# EAGLE design CampLet_Power_Control (EAGLE 9.6.2)
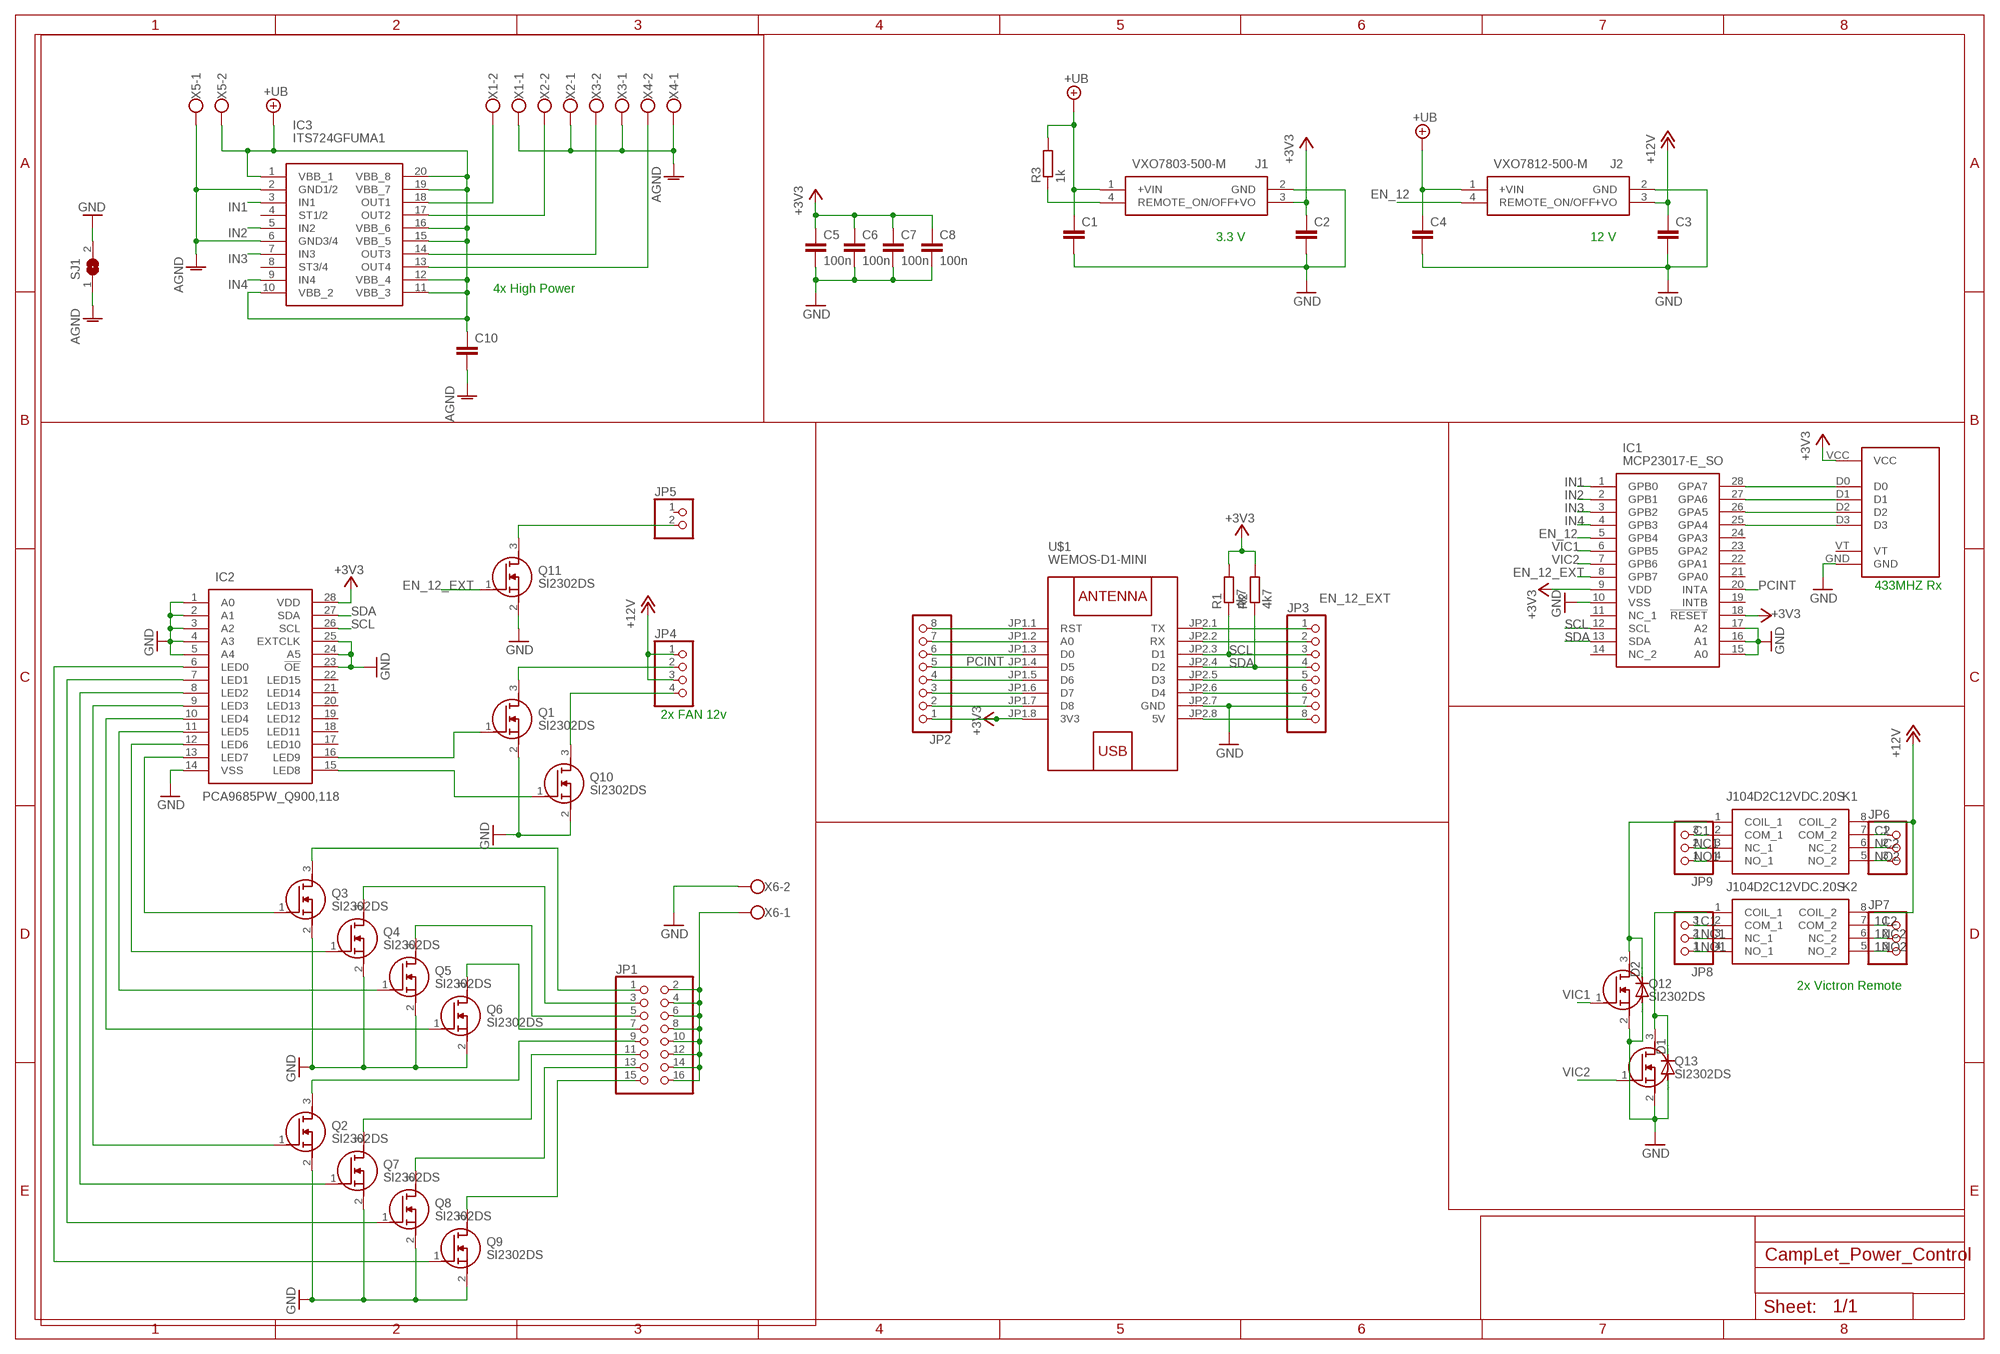
[diagram p0: schematic, sheet 1]

## Parts
C1  10u 30v CL31A106KBHNNNE  C-EUC1206  [C1206]
C2  22u 3.3v CL31A226MOCLNNC  C-EUC1206  [C1206]
C3  22u 12v CL31A226MOCLNNC  C-EUC1206  [C1206]
C4  10u 30v CL31A106KBHNNNE  C-EUC1206  [C1206]
C5  100n  C-EUC0805  [C0805]
C6  100n  C-EUC0805  [C0805]
C7  100n  C-EUC0805  [C0805]
C8  100n  C-EUC0805  [C0805]
C10  10u 30v CL31A106KBHNNNE  C-EUC1206  [C1206]
D1  1N4148DO35-7  [DO35-7]
D2  1N4148DO35-7  [DO35-7]
IC1  MCP23017-E_SO  [SOIC127P1030X265-28N]
IC2  PCA9685PW_Q900,118  [SOP65P640X110-28N]
IC3  ITS724GFUMA1  [SOIC127P1030X265-20N]
J1  VXO7803-500-M  VXO7803-500-M-TR  [VXO7803500MTR]
J2  VXO7812-500-M  VXO7803-500-M-TR  [VXO7803500MTR]
JP1  PINHD-2X8  [2X08]
JP2  PINHD-1X8  [1X08]
JP3  PINHD-1X8  [1X08]
JP4  PINHD-1X4  [1X04]
JP5  PINHD-1X2  [1X02]
JP6  PINHD-1X3  [1X03]
JP7  PINHD-1X3  [1X03]
JP8  PINHD-1X3  [1X03]
JP9  PINHD-1X3  [1X03]
K1  J104D2C12VDC.20S  [J104D2C12VDC20S]
K2  J104D2C12VDC.20S  [J104D2C12VDC20S]
Q1  SI2302DS  [SOT95P230X110-3N]
Q2  SI2302DS  [SOT95P230X110-3N]
Q3  SI2302DS  [SOT95P230X110-3N]
Q4  SI2302DS  [SOT95P230X110-3N]
Q5  SI2302DS  [SOT95P230X110-3N]
Q6  SI2302DS  [SOT95P230X110-3N]
Q7  SI2302DS  [SOT95P230X110-3N]
Q8  SI2302DS  [SOT95P230X110-3N]
Q9  SI2302DS  [SOT95P230X110-3N]
Q10  SI2302DS  [SOT95P230X110-3N]
Q11  SI2302DS  [SOT95P230X110-3N]
Q12  SI2302DS  [SOT95P230X110-3N]
Q13  SI2302DS  [SOT95P230X110-3N]
R1  4k7  R-EU_R0805  [R0805]
R2  4k7  R-EU_R0805  [R0805]
R3  1k  R-EU_R0805  [R0805]
SJ1  SJ  [SJ]
U$1  WEMOS-D1-MINI  [WEMOS-D1-MINI]
U$2  433MHZ  [433MHZ]
X1  W237-102  [W237-102]
X2  W237-102  [W237-102]
X3  W237-102  [W237-102]
X4  W237-102  [W237-102]
X5  W237-102  [W237-102]
X6  W237-102  [W237-102]

## Nets
1C1: JP8.3 K2.2(COM_1)
1C2: JP7.1 K2.7(COM_2)
1NC1: JP8.2 K2.3(NC_1)
1NC2: JP7.2 K2.6(NC_2)
1NO1: JP8.1 K2.4(NO_1)
1NO2: JP7.3 K2.5(NO_2)
+3V3: C2.1 C5.1 C6.1 C7.1 C8.1 IC1.9(VDD) IC1.18(!RESET) IC2.28(VDD) J1.3(+VO) JP2.1 R1.2 R2.2 U$1.JP1.8(3V3) U$2.VCC
+12V: C3.1 J2.3(+VO) JP4.1 JP4.3 K1.8(COIL_2) K2.8(COIL_2)
+UB: C1.1 C4.1 C10.1 IC3.1(VBB_1) IC3.10(VBB_2) IC3.11(VBB_3) IC3.12(VBB_4) IC3.15(VBB_5) IC3.16(VBB_6) IC3.19(VBB_7) IC3.20(VBB_8) J1.1(+VIN) J2.1(+VIN) R3.2 X5.2
AGND: C10.2 IC3.2(GND1/2) IC3.6(GND3/4) SJ1.1 X1.1 X2.1 X3.1 X4.1 X5.1
C1: JP9.3 K1.2(COM_1)
C2: JP6.1 K1.7(COM_2)
EN_12: IC1.5(GPB4) J2.4(REMOTE_ON/OFF)
EN_12_EXT: IC1.8(GPB7) Q11.1(G)
GND: C1.2 C2.2 C3.2 C4.2 C5.2 C6.2 C7.2 C8.2 D1.A D2.A IC1.10(VSS) IC1.15(A0) IC1.16(A1) IC1.17(A2) IC2.1(A0) IC2.2(A1) IC2.3(A2) IC2.4(A3) IC2.5(A4) IC2.14(VSS) IC2.23(!OE) IC2.24(A5) IC2.25(EXTCLK) J1.2(GND) J2.2(GND) JP3.7 Q1.2(S) Q2.2(S) Q3.2(S) Q4.2(S) Q5.2(S) Q6.2(S) Q7.2(S) Q8.2(S) Q9.2(S) Q10.2(S) Q11.2(S) Q12.2(S) Q13.2(S) SJ1.2 U$1.JP2.7(GND) U$2.GND X6.2
IN1: IC1.1(GPB0) IC3.3(IN1)
IN2: IC1.2(GPB1) IC3.5(IN2)
IN3: IC1.3(GPB2) IC3.7(IN3)
IN4: IC1.4(GPB3) IC3.9(IN4)
N$1: IC1.28(GPA7) U$2.D0
N$2: IC1.27(GPA6) U$2.D1
N$3: IC1.26(GPA5) U$2.D2
N$4: IC1.25(GPA4) U$2.D3
N$5: IC2.12(LED6) Q4.1(G)
N$6: IC2.13(LED7) Q3.1(G)
N$7: IC2.11(LED5) Q5.1(G)
N$8: IC2.10(LED4) Q6.1(G)
N$9: IC2.9(LED3) Q2.1(G)
N$10: IC2.8(LED2) Q7.1(G)
N$11: IC2.7(LED1) Q8.1(G)
N$12: IC2.6(LED0) Q9.1(G)
N$13: JP1.9 Q2.3(D)
N$14: JP1.11 Q7.3(D)
N$15: JP1.13 Q8.3(D)
N$16: JP1.15 Q9.3(D)
N$17: JP1.1 Q3.3(D)
N$18: JP1.3 Q4.3(D)
N$19: JP1.5 Q5.3(D)
N$20: JP1.7 Q6.3(D)
N$21: JP1.2 JP1.4 JP1.6 JP1.8 JP1.10 JP1.12 JP1.14 JP1.16 X6.1
N$22: IC3.17(OUT2) X2.2
N$23: IC3.14(OUT3) X3.2
N$24: IC3.13(OUT4) X4.2
N$25: JP3.8 U$1.JP2.8(5V)
N$26: IC2.16(LED9) Q1.1(G)
N$27: JP3.6 U$1.JP2.6(D4)
N$28: JP3.5 U$1.JP2.5(D3)
N$29: JP3.2 U$1.JP2.2(RX)
N$30: JP3.1 U$1.JP2.1(TX)
N$31: JP2.2 U$1.JP1.7(D8)
N$32: JP2.3 U$1.JP1.6(D7)
N$33: JP2.4 U$1.JP1.5(D6)
N$34: JP2.6 U$1.JP1.3(D0)
N$35: JP2.7 U$1.JP1.2(A0)
N$36: JP2.8 U$1.JP1.1(RST)
N$38: J1.4(REMOTE_ON/OFF) R3.1
N$39: IC2.15(LED8) Q10.1(G)
N$41: JP5.2 Q11.3(D)
N$43: D2.C K1.1(COIL_1) Q12.3(D)
N$44: JP4.2 Q1.3(D)
N$45: JP4.4 Q10.3(D)
N$46: D1.C K2.1(COIL_1) Q13.3(D)
NC1: JP9.2 K1.3(NC_1)
NC2: JP6.2 K1.6(NC_2)
NO1: JP9.1 K1.4(NO_1)
NO2: JP6.3 K1.5(NO_2)
OUT1: IC3.18(OUT1) X1.2
PCINT: IC1.20(INTA) JP2.5 U$1.JP1.4(D5)
SCL: IC1.12(SCL) IC2.26(SCL) JP3.3 R1.1 U$1.JP2.3(D1)
SDA: IC1.13(SDA) IC2.27(SDA) JP3.4 R2.1 U$1.JP2.4(D2)
VIC1: IC1.6(GPB5) Q12.1(G)
VIC2: IC1.7(GPB6) Q13.1(G)
Unconnected: IC1.11(NC_1) IC1.14(NC_2) IC1.19(INTB) IC1.21(GPA0) IC1.22(GPA1) IC1.23(GPA2) IC1.24(GPA3) IC2.17(LED10) IC2.18(LED11) IC2.19(LED12) IC2.20(LED13) IC2.21(LED14) IC2.22(LED15) IC3.4(ST1/2) IC3.8(ST3/4) JP5.1 U$2.VT

## Notes on the sheet
- 3.3 V | 12 V
- 4x High Power
- 433MHZ Rx
- 2x FAN 12v
- 2x Victron Remote

## Library data of the parts
C1-C8 C10 = rcl:C-EU: CAPACITOR, European symbol; SPICEPREFIX: C
D1 D2 = diode:1N4148: DIODE high speed (Philips)
IC1 = MCP23017-E_SO:MCP23017-E_SO: 16-bit I/O Expander,I2C,MCP23017-E/SO Source: Datasheet <http://docs-emea.rs-online.com/webdocs/0a78/0900766b80a784c3.pdf>; ARROW_PART_NUMBER: MCP23017-E/SO; ARROW_PRICE-STOCK: https://www.arrow.com/en/products/mcp23017-eso/microchip-technology; DESCRIPTION: 16-bit I/O Expander,I2C,MCP23017-E/SO; HEIGHT: 2.65mm; MANUFACTURER_NAME: Microchip; MANUFACTURER_PART_NUMBER: MCP23017-E/SO; MOUSER_PART_NUMBER: 579-MCP23017-E/SO; MOUSER_PRICE-STOCK: https://www.mouser.co.uk/ProductDetail/Microchip-Technology/MCP23017-E-SO?qs=usxtMOJb1Rz8hft7vV7YMQ%3D%3D
IC2 = PCA9685PW_Q900_118:PCA9685PW_Q900,118: NXP - PCA9685PW/Q900,118 - LED DRIVER, AEC-Q100, 16-CH, TSSOP-20 Source: Datasheet <http://www.nxp.com/docs/en/data-sheet/PCA9685.pdf>; ARROW_PART_NUMBER: PCA9685PW/Q900,118; ARROW_PRICE-STOCK: https://www.arrow.com/en/products/pca9685pwq900118/nxp-semiconductors; DESCRIPTION: NXP - PCA9685PW/Q900,118 - LED DRIVER, AEC-Q100, 16-CH, TSSOP-20; HEIGHT: 1.1mm; MANUFACTURER_NAME: NXP; MANUFACTURER_PART_NUMBER: PCA9685PW/Q900,118; MOUSER_PART_NUMBER: 771-PCA9685PWQ900118; MOUSER_PRICE-STOCK: https://www.mouser.co.uk/ProductDetail/NXP-Semiconductors/PCA9685PW-Q900118/?qs=MWRe%252BjyhxRtZfKNN86P1Tg%3D%3D
IC3 = ITS724GFUMA1:ITS724GFUMA1: INFINEON - ITS724GFUMA1 - IC, 4CH HIGH SIDE PWR SWITCH, DSO-20 Source: Datasheet <https://www.infineon.com/dgdl/Infineon-ITS724G-DS-v01_01-en.pdf?fileId=db3a304412b407950112b428d6083e90>; ARROW_PART_NUMBER: ITS724GFUMA1; ARROW_PRICE-STOCK: https://www.arrow.com/en/products/its724gfuma1/infineon-technologies-ag; DESCRIPTION: INFINEON - ITS724GFUMA1 - IC, 4CH HIGH SIDE PWR SWITCH, DSO-20; HEIGHT: 2.65mm; MANUFACTURER_NAME: Infineon; MANUFACTURER_PART_NUMBER: ITS724GFUMA1; MOUSER_PART_NUMBER: 726-ITS724GFUMA1; MOUSER_PRICE-STOCK: https://www.mouser.co.uk/ProductDetail/Infineon-Technologies/ITS724GFUMA1?qs=OwbwYO03UsLF67j8ijxCVQ%3D%3D
J1 J2 = VXO7803-500-M-TR:VXO7803-500-M-TR: Non-Isolated DC/DC Converters dc-dc non-isolated, 0.5 A, 4.75~36 Vdc input, 3.3 Vdc output, SMT, open frame, tape and reel Source: Datasheet <https://www.mouser.ch/datasheet/2/670/vxo78-500-m-1729064.pdf>; ARROW_PART_NUMBER: VXO7803-500-M-TR; ARROW_PRICE-STOCK: https://www.arrow.com/en/products/vxo7803-500-m-tr/cui-inc; DESCRIPTION: Non-Isolated DC/DC Converters dc-dc non-isolated, 0.5 A, 4.75~36 Vdc input, 3.3 Vdc output, SMT, open frame, tape and reel; HEIGHT: 3.5mm; MANUFACTURER_NAME: CUI Inc.; MANUFACTURER_PART_NUMBER: VXO7803-500-M-TR; MOUSER_PART_NUMBER: 490-VXO7803-500-M-TR; MOUSER_PRICE-STOCK: https://www.mouser.co.uk/ProductDetail/CUI-Inc/VXO7803-500-M-TR?qs=GBLSl2AkiruqsgUrpmz5tw%3D%3D
JP1 = pinhead:PINHD-2X8: PIN HEADER
JP2 JP3 = pinhead:PINHD-1X8: PIN HEADER
JP4 = pinhead:PINHD-1X4: PIN HEADER
JP5 = pinhead:PINHD-1X2: PIN HEADER
JP6-JP9 = pinhead:PINHD-1X3: PIN HEADER
K1 K2 = J104D2C12VDC.20S:J104D2C12VDC.20S: Relay 20.4 x 10.05 x 11.0 mm DPDT 20W Source: Datasheet <https://www.citrelay.com/Catalog Pages/RelayCatalog/J104D.pdf>; DESCRIPTION: Relay 20.4 x 10.05 x 11.0 mm DPDT 20W; HEIGHT: 11.42mm; MANUFACTURER_NAME: CITRelay; MANUFACTURER_PART_NUMBER: J104D2C12VDC.20S
Q1-Q13 = SI2302DS:SI2302DS: NXP SI2302DS N-channel MOSFET Transistor, 2.5 A, 20 V, 3-Pin TO-236AB Source: Datasheet <https://assets.nexperia.com/documents/data-sheet/SI2302DS.pdf>; DESCRIPTION: NXP SI2302DS N-channel MOSFET Transistor, 2.5 A, 20 V, 3-Pin TO-236AB; HEIGHT: 1.1mm; MANUFACTURER_NAME: Nexperia; MANUFACTURER_PART_NUMBER: SI2302DS; MOUSER_PART_NUMBER: N/A; MOUSER_PRICE-STOCK: https://www.mouser.com/Search/Refine.aspx?Keyword=N%2FA
R1-R3 = rcl:R-EU_: RESISTOR, European symbol; SPICEPREFIX: R
SJ1 = jumper:SJ: SMD solder JUMPER
U$1 = diy-modules:WEMOS-D1-MINI: WEMOS D1 mini: Mini Wi-Fi Board based on ESP-8266 device More details can be found here: https://www.wemos.cc/product/d1-mini.html Click here to find device on ebay.com <http://www.ebay.com/sch/wemos+d1+mini+nodemcu>
U$2 = 433Mhz:433MHZ
X1-X6 = con-wago-500:W237-102: WAGO SCREW CLAMP; MPN: 237-102; OC_FARNELL: unknown; OC_NEWARK: 70K9898

## Board
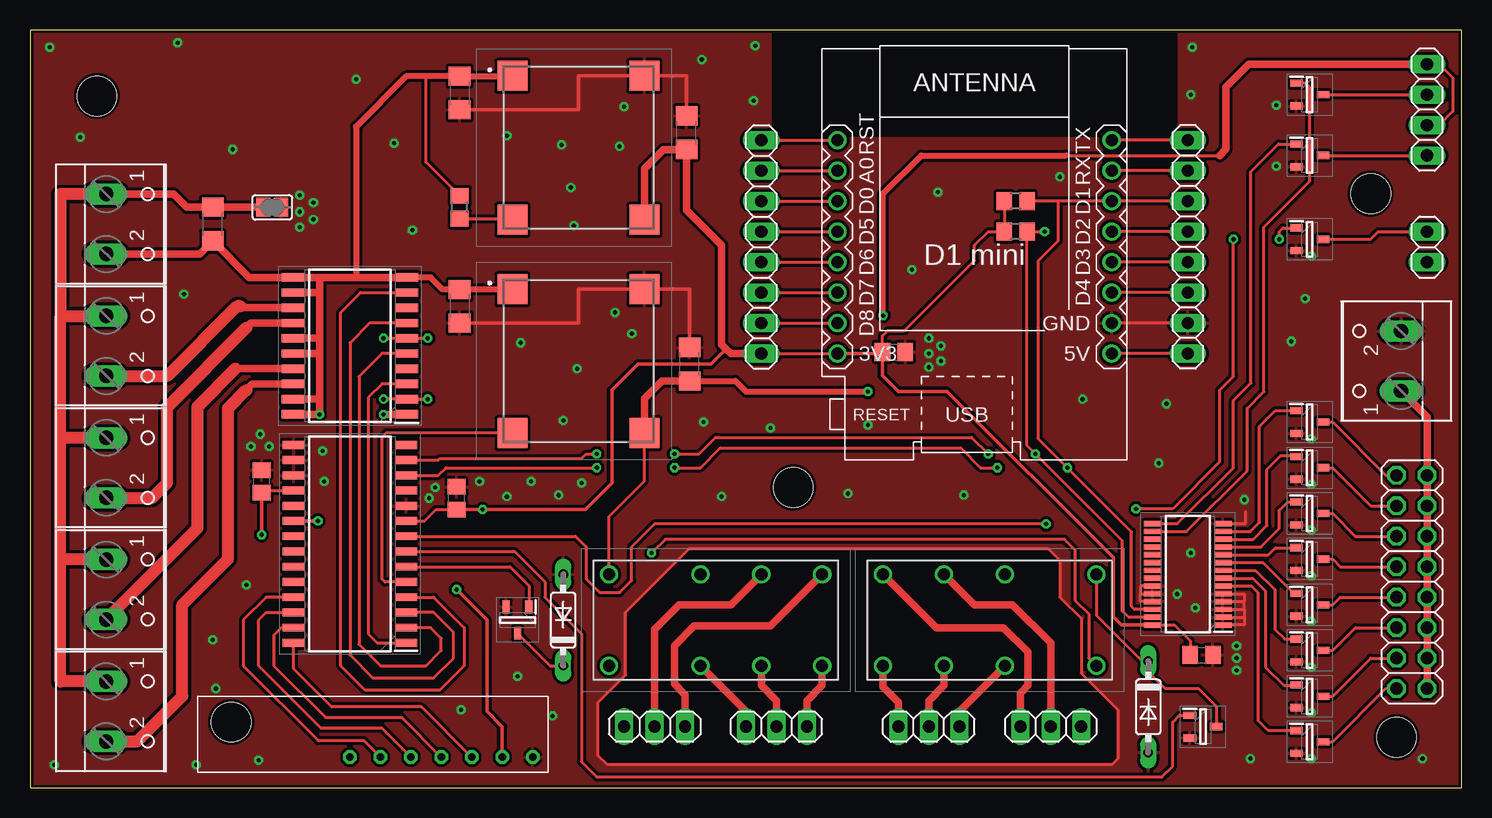
[diagram p1: board, top side]
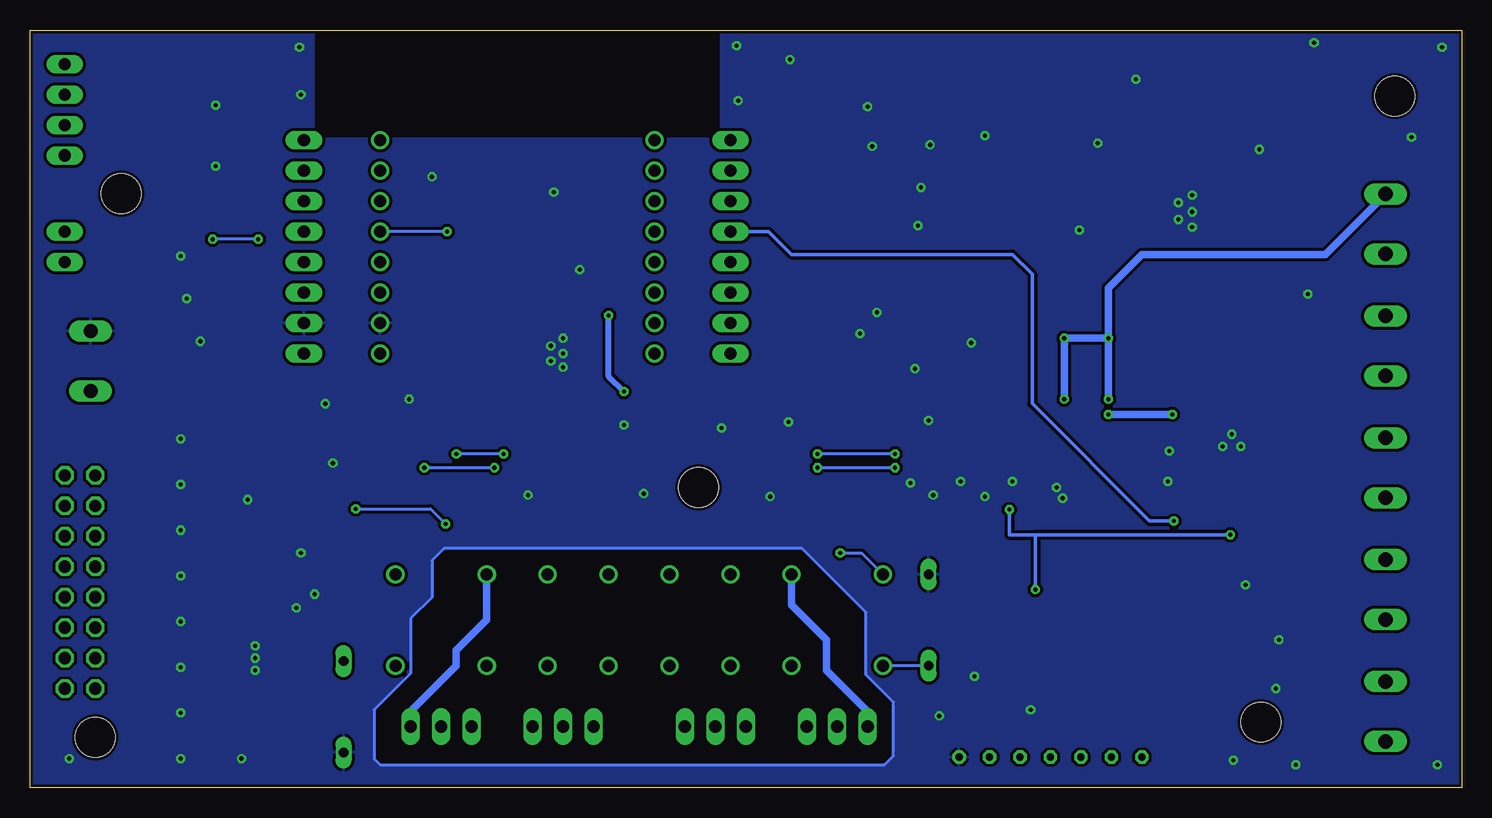
[diagram p2: board, bottom side, seen from below]

Size 119.36 x 63.17 mm. Coordinates in mm from the lower left corner, seen from the top.
Outline: 0,0 119.36,0 119.36,63.17 0,63.17 0,0
Copper layers (1*16): Top 0.035mm / dielectric 1.5mm / Bottom 0.035mm
Design rules "jlcpcb": minimum track width 3.5mil, minimum drill 0.2mm, track to track 3.5mil, track to pad 5mil, pad to pad 5mil, via to via 5mil, smd to smd 5mil, copper to edge 0.2mm, drill to drill 8mil, minimum pad ring 10mil, minimum via ring 8mil, stop-mask expansion 4mil, vias tented up to drill 0mil, thermal gap 10mil
Holes 3.3 mm at 63.63,25.02 5.59,57.66 111.76,49.53 113.92,4.19 16.76,5.46
tRestrict: area 62.2,54.6 to 95.2,63.5; area 47.6,2.2 to 90.4,19.7
bRestrict: area 62.2,54.6 to 95.2,63.5; area 47.6,2.2 to 90.4,19.7

### Footprints (pad centres in the part's own frame; a part is rotated, then mirrored left to right if it is on the bottom)
C1206 = smd 1.6 x 1.8: 1 -1.4,0; 2 1.4,0
C0805 = smd 1.3 x 1.5: 1 -0.95,0; 2 0.95,0
DO35-7 = drill 0.813 long: A 3.81,0; C -3.81,0
SOIC127P1030X265-28N = smd 1.85 x 0.65: 1 -4.675,8.255; 2 -4.675,6.985; 3 -4.675,5.715; 4 -4.675,4.445; 5 -4.675,3.175; 6 -4.675,1.905; 7 -4.675,0.635; 8 -4.675,-0.635; 9 -4.675,-1.905; 10 -4.675,-3.175; 11 -4.675,-4.445; 12 -4.675,-5.715; 13 -4.675,-6.985; 14 -4.675,-8.255; 15 4.675,-8.255; 16 4.675,-6.985; 17 4.675,-5.715; 18 4.675,-4.445; 19 4.675,-3.175; 20 4.675,-1.905; 21 4.675,-0.635; 22 4.675,0.635; 23 4.675,1.905; 24 4.675,3.175; 25 4.675,4.445; 26 4.675,5.715; 27 4.675,6.985; 28 4.675,8.255
SOP65P640X110-28N = smd 1.475 x 0.45: 1 -2.938,4.225; 2 -2.938,3.575; 3 -2.938,2.925; 4 -2.938,2.275; 5 -2.938,1.625; 6 -2.938,0.975; 7 -2.938,0.325; 8 -2.938,-0.325; 9 -2.938,-0.975; 10 -2.938,-1.625; 11 -2.938,-2.275; 12 -2.938,-2.925; 13 -2.938,-3.575; 14 -2.938,-4.225; 15 2.938,-4.225; 16 2.938,-3.575; 17 2.938,-2.925; 18 2.938,-2.275; 19 2.938,-1.625; 20 2.938,-0.975; 21 2.938,-0.325; 22 2.938,0.325; 23 2.938,0.975; 24 2.938,1.625; 25 2.938,2.275; 26 2.938,2.925; 27 2.938,3.575; 28 2.938,4.225
SOIC127P1030X265-20N = smd 1.925 x 0.7: 1 -4.712,5.715; 2 -4.712,4.445; 3 -4.712,3.175; 4 -4.712,1.905; 5 -4.712,0.635; 6 -4.712,-0.635; 7 -4.712,-1.905; 8 -4.712,-3.175; 9 -4.712,-4.445; 10 -4.712,-5.715; 11 4.712,-5.715; 12 4.712,-4.445; 13 4.712,-3.175; 14 4.712,-1.905; 15 4.712,-0.635; 16 4.712,0.635; 17 4.712,1.905; 18 4.712,3.175; 19 4.712,4.445; 20 4.712,5.715
VXO7803500MTR = smd 2.5 x 2.5: 1 -5.5,6; 2 5.5,6; 3 5.5,-6; 4 -5.5,-6
2X08 = drill 1.016 octagon: 1 -8.89,-1.27; 2 -8.89,1.27; 3 -6.35,-1.27; 4 -6.35,1.27; 5 -3.81,-1.27; 6 -3.81,1.27; 7 -1.27,-1.27; 8 -1.27,1.27; 9 1.27,-1.27; 10 1.27,1.27; 11 3.81,-1.27; 12 3.81,1.27; 13 6.35,-1.27; 14 6.35,1.27; 15 8.89,-1.27; 16 8.89,1.27
1X08 = drill 1.016 long: 1 -8.89,0; 2 -6.35,0; 3 -3.81,0; 4 -1.27,0; 5 1.27,0; 6 3.81,0; 7 6.35,0; 8 8.89,0
1X04 = drill 1.016 long: 1 -3.81,0; 2 -1.27,0; 3 1.27,0; 4 3.81,0
1X02 = drill 1.016 long: 1 -1.27,0; 2 1.27,0
1X03 = drill 1.016 long: 1 -2.54,0; 2 0,0; 3 2.54,0
J104D2C12VDC20S = drill 1 pad 1.5: 1 0,-7.62; 2 7.62,-7.62; 3 12.7,-7.62; 4 17.78,-7.62; 5 17.78,0; 6 12.7,0; 7 7.62,0; 8 0,0
SOT95P230X110-3N = smd 1.05 x 0.6: 1 -1.1,0.95; 2 -1.1,-0.95; 3 1.1,0
R0805 = smd 1.3 x 1.5: 1 -0.95,0; 2 0.95,0
SJ = smd 1.168 x 1.6: 1 -0.762,0; 2 0.762,0
WEMOS-D1-MINI = drill 1: JP1.1 -11.43,9.525; JP1.2 -11.43,6.985; JP1.3 -11.43,4.445; JP1.4 -11.43,1.905; JP1.5 -11.43,-0.635; JP1.6 -11.43,-3.175; JP1.7 -11.43,-5.715; JP1.8 -11.43,-8.255; JP2.1 11.43,9.525; JP2.2 11.43,6.985; JP2.3 11.43,4.445; JP2.4 11.43,1.905; JP2.5 11.43,-0.635; JP2.6 11.43,-3.175; JP2.7 11.43,-5.715; JP2.8 11.43,-8.255
433MHZ = drill 0.6 octagon: D0 -5.08,0; D1 -7.62,0; D2 -10.16,0; D3 -12.7,0; GND 0,0; VCC -2.54,0; VT -15.24,0
W237-102 = drill 1.194 long: 1 -2.5,-1.27; 2 2.5,-1.27

### Placement (x,y rotation side)
C1  35.81,40.13 270 top
C2  54.74,54.61 90 top
C3  54.99,35.31 90 top
C4  35.81,57.91 270 top
C5  19.3,25.53 90 top
C6  35.56,24.13 90 top
C7  97.66,11.05 0 top
C8  72.01,36.32 0 top
C10  15.24,46.99 90 top
D1  93.22,6.73 270 top
D2  44.45,13.97 90 top
IC1  26.67,20.32 180 top
IC2  96.52,17.78 180 top
IC3  26.67,36.83 180 top
J1  45.72,53.34 0 top
J2  45.72,35.56 0 top
JP1  115.19,17.14 270 top
JP2  60.96,45.09 90 top
JP3  96.52,45.09 270 top
JP4  116.46,56.52 270 top
JP5  116.46,45.09 90 top
JP6  52.07,5.08 0 top
JP7  74.93,5.08 180 top
JP8  85.09,5.08 0 top
JP9  62.23,5.08 180 top
K1  48.26,17.78 0 top
K2  88.9,10.16 180 top
Q1  106.68,57.78 0 top
Q2  106.68,15.24 0 top
Q3  106.68,30.48 0 top
Q4  106.68,26.67 0 top
Q5  106.68,22.86 0 top
Q6  106.68,19.05 0 top
Q7  106.68,11.43 0 top
Q8  106.68,7.62 0 top
Q9  106.68,3.81 0 top
Q10  106.68,52.7 0 top
Q11  106.68,45.72 0 top
Q12  40.64,13.97 270 top
Q13  97.79,5.08 0 top
R1  82.17,48.9 180 top
R2  82.17,46.35 180 top
R3  35.81,48.39 90 top
SJ1  20.19,48.39 0 top
U$1  78.74,44.45 0 top
U$2  41.91,2.54 0 top
X1  7.62,6.35 270 top
X2  7.62,16.51 270 top
X3  7.62,26.67 270 top
X4  7.62,36.83 270 top
X5  7.62,46.99 270 top
X6  113.03,35.56 90 top

### Tracks (layer width: path | path; a pad name or v marks a point on that pad's centre or on a via)
1C1
  Bottom 0.61: JP8.3 87.63,6.35 83.82,10.16 83.82,11.43 81.28,13.97 K2.2
1C2
  Top 0.61: JP7.1 77.47,6.35 K2.7
1NC1
  Top 0.61: K2.3 78.74,15.24 81.92,15.24 85.09,12.06 JP8.2
1NC2
  Top 0.61: JP7.2 74.93,7.24 76.2,8.51 K2.6
1NO1
  Top 0.61: JP8.1 82.55,7.87 83.19,8.51 83.19,11.3 81.15,13.34 75.56,13.34 K2.4
1NO2
  Top 0.61: JP7.3 72.39,7.11 71.12,8.38 K2.5
+3V3  (via drill 0.35)
  Top 0.254: JP2.1 U$1.JP1.8 | C5.1 19.49,24.77 IC1.18 | IC1.9 32.89,22.23 33.85,23.18 C6.1 | IC2.28 95.41,13.55 96.71,12.25 C7.1 | C8.1 71.06,37.66 71.5,38.1 72.9,38.1 78.74,43.94 78.74,45.21 79.88,46.35 R2.2 R1.2
  Top 0.305: C6.1 v37.72,23.18 46.29,23.18 48.51,25.4 48.51,33.15 50.67,35.31 56.77,35.31 58.04,36.58 | U$1.JP1.8 70.93,36.2 C8.1 71.06,34.35 72.39,33.02 76.45,33.02 90.3,19.18 90.3,14.22 90.97,13.55 IC2.28 | U$2.VCC 39.37,5.08 38.1,6.35 38.1,13.97 v35.56,16.51 | C5.1 v19.3,21.08
  Top 0.61: JP2.1 58.42,36.2 58.04,36.58 57.66,36.96 57.66,45.21 54.74,48.13 C2.1 52.83,53.21 51.22,51.6 J1.3
  Bottom 0.305: v19.3,21.08 35.56,21.08 | 35.56,21.08 v35.56,16.51 | v37.72,23.18 37.72,21.08 35.56,21.08
+12V  (via drill 0.35)
  Top 0.254: JP4.1 117.47,60.33 118.62,59.18 118.62,56.39 117.47,55.24 JP4.3 | 86.36,52.7 99.19,52.7 | K1.8 48.26,22.61 51.22,25.57 J2.3 | v51.82,19.56 52.96,20.7 86.23,20.7 87.12,19.81 87.12,15.62 88.27,14.48 88.27,10.79 K2.8
  Top 0.508: C3.1 58.8,33.91 59.69,33.02 v69.85,33.02 | v71.12,39.37 71.12,49.53 74.3,52.7 86.36,52.7
  Top 0.61: 99.19,52.7 99.69,53.21 99.69,58.42 101.6,60.33 JP4.1 | J2.3 51.22,32.42 52.7,33.91 C3.1
  Bottom 0.254: v51.82,19.56 50.04,19.56 K1.8
  Bottom 0.508: v69.85,33.02 71.12,34.29 v71.12,39.37
+UB  (via drill 0.35)
  Top 0.254: R3.2 33.02,52.13 33.02,59.31
  Top 0.508: J2.1 35.84,41.56 C1.1 34.41,41.53 33.4,42.55 IC3.10 | J1.1 40.19,59.31 C4.1 33.02,59.31 31.37,59.31 27.18,55.12 27.18,42.55
  Top 0.61: IC3.20 v24.13,31.11 24.13,32.38 | 24.13,42.55 IC3.11 18.29,42.55 C10.1 14.14,44.49 X5.2 | 24.13,42.55 24.13,41.27 | 24.13,41.27 24.13,37.47 | 24.13,36.2 24.13,32.38 | IC3.12 24.13,41.27 | IC3.19 24.13,32.38 | IC3.16 24.13,36.2 | IC3.15 24.13,37.47 | 24.13,37.47 24.13,36.2 | IC3.10 27.18,42.55 24.13,42.55 | IC3.1 v29.46,31.11
  Bottom 0.61: v29.46,31.11 v24.13,31.11
AGND  (via drill 0.35)
  Top 0.254: v29.46,37.47 IC3.6 v33.15,37.47 | v33.15,32.38 IC3.2 v29.46,32.38
  Top 0.61: X5.1 11.98,49.49 13.08,48.39 C10.2 SJ1.1
  Top 1.016: X5.1 2.54,49.49 2.54,39.33 | 2.54,39.33 X4.1 | X3.1 2.54,29.17 | 2.54,29.17 2.54,39.33 | X2.1 2.54,19.01 | 2.54,19.01 2.54,29.17 | X1.1 2.54,8.85 2.54,19.01
  Bottom 0.61: v33.15,32.38 v33.15,37.47 v29.46,37.47 | v29.46,32.38 v29.46,37.47 | v29.46,37.47 29.46,41.66 26.67,44.45 11.39,44.45 X5.1
C1
  Top 0.61: JP9.3 59.69,6.35 K1.2
C2
  Bottom 0.61: JP6.1 49.53,6.35 52.96,9.78 52.96,12.32 55.88,15.24 K1.7
EN_12
  Top 0.254: IC1.5 29.59,17.14 29.34,17.4 29.34,29.21 29.72,29.59 40.19,29.59 J2.4
EN_12_EXT  (via drill 0.35)
  Top 0.254: v100.33,45.72 100.33,34.29 99.19,33.15 99.19,27.18 95.25,23.24 v92.2,23.24 | v104.14,45.72 104.14,46.35 104.45,46.67 Q11.1 | IC1.8 45.47,20.95 46.35,20.07 46.35,17.4 47.5,16.26 49.15,16.26 50.16,17.27 50.16,20.07 52.07,21.97 v84.71,21.97
  Bottom 0.254: v100.33,45.72 v104.14,45.72 | v92.2,23.24 85.98,23.24 v84.71,21.97
GND  (via drill 0.35)
  Top 0.254: IC2.5 101.22,16.16 101.22,15.51 | IC2.1 101.22,13.55 101.22,14.21 | 101.22,14.86 101.22,14.21 | IC2.2 101.22,14.21 | IC2.3 101.22,14.86 | 101.22,14.86 101.22,15.51 | IC2.4 101.22,15.51 | IC2.14 101.35,22 101.35,22.99 | IC2.25 92.58,15.51 92.58,16.16 | 92.58,16.16 IC2.24 | IC2.23 92.58,16.8 92.58,16.16 | JP3.7 U$1.JP2.7 | 54.99,19.94 84.84,19.94 85.85,18.92 85.85,15.88 87.63,14.1 87.63,9.53 90.68,6.48 90.68,2.41 90.17,1.91 48.13,1.91 47.37,2.67 47.37,7.11 49.66,9.4 49.66,14.61 54.99,19.94
  Top 0.305: C2.2 54.74,59.34 J1.2 45.72,59.34 45.72,56.51 C4.2 | C3.2 54.99,41.56 J2.2 45.72,41.56 45.72,38.73 C1.2
  Bottom 0.254: 54.99,19.94 84.84,19.94 85.85,18.92 85.85,15.88 87.63,14.1 87.63,9.53 90.68,6.48 90.68,2.41 90.17,1.91 48.13,1.91 47.37,2.67 47.37,7.11 49.66,9.4 49.66,14.61 54.99,19.94
  other vias: 74.93,37.47 74.93,35.05 74.93,36.2 75.95,36.83 75.95,35.56 101.22,24 100.58,11.81 100.58,10.79 100.58,9.78 18.41,28.45 19.94,28.45 19.18,29.46 22.48,46.74 22.48,48.01 22.48,49.4 23.62,48.77 23.62,47.37 39.75,54.36 49.53,56.77 45.09,50.04 49.15,53.47 40.89,37.08 48.77,39.62 45.59,34.92 44.45,30.61 50.16,37.85 44.32,53.59 45.34,46.86 57.66,24.26 77.85,24.38 68.2,24.51 101.73,2.41 116.08,2.41 96.9,61.72 94.74,32 94.11,27.05 33.27,24.13 33.78,25.02 37.47,25.53 39.75,24.26 41.78,25.53 44.07,24.38 45.97,25.4 56.13,30.48 61.72,29.97 69.85,30.23 106.81,2.41 106.81,6.22 106.81,10.03 106.81,13.84 106.81,17.65 106.81,21.46 106.81,29.08 106.81,25.27 106.81,44.32 103.89,51.82 103.89,56.9 96.77,57.78 60.45,61.85 60.33,57.28 56.01,60.71 1.65,61.72 4.19,54.23 12.32,62.1 16.89,53.21 27.18,59.05 105.16,37.21 13.84,1.91 19.05,2.29 15.49,8.26 2.03,1.91 12.83,41.15 73.53,43.18 75.69,49.66 85.85,50.93 87.76,32.38 30.35,53.72 31.88,46.48 18.03,16.89 15.24,12.32 40.64,9.27 43.56,5.97 106.3,40.77 96.77,19.56 95.63,16.13 97.16,14.99 24.38,28.07 24.51,25.53 35.94,6.48
  pour Top (isolate 0.254): 0,63.5 0,0 119.38,0 119.38,63.5
  pour Bottom (isolate 0.254): 0,63.5 119.38,63.5 119.38,0 0,0
IN1
  Top 0.254: IC3.3 29.34,33.66 28.19,32.51 28.19,12.83 28.96,12.06 IC1.1
IN2
  Top 0.254: IC3.5 29.34,36.2 27.43,34.29 27.43,11.94 29.21,10.16 33.02,10.16 34.29,11.43 34.29,12.45 33.4,13.34 IC1.2
IN3
  Top 0.254: IC3.7 28.32,38.73 26.67,37.08 26.67,11.05 28.57,9.14 33.66,9.14 35.31,10.79 35.31,12.95 33.66,14.61 IC1.3
IN4
  Top 0.254: IC1.4 33.66,15.88 36.2,13.34 36.2,10.16 34.16,8.13 27.94,8.13 25.91,10.16 25.91,39.62 27.56,41.27 IC3.9
N$1
  Top 0.254: U$2.D0 32.64,6.73 25.15,6.73 22,9.88 IC1.28
N$2
  Top 0.254: IC1.27 20.95,13.34 20.32,12.7 20.32,10.16 24.64,5.84 30.99,5.84 U$2.D1
N$3
  Top 0.254: U$2.D2 29.34,4.95 24.26,4.95 19.05,10.16 19.05,13.97 19.68,14.61 IC1.26
N$4
  Top 0.254: IC1.25 19.68,15.88 17.78,13.97 17.78,10.16 24,3.94 27.81,3.94 U$2.D3
N$5
  Top 0.254: IC2.12 101.98,20.7 103.12,21.84 103.12,26.54 104.27,27.69 105.51,27.69 Q4.1
N$6
  Top 0.254: IC2.13 101.75,21.36 102.49,22.1 102.49,30.1 103.82,31.43 Q3.1
N$7
  Top 0.254: IC2.11 102.61,20.05 104.14,21.59 104.14,23.11 104.84,23.81 Q5.1
N$8
  Top 0.254: IC2.10 103.22,19.41 103.82,20 Q6.1
N$9
  Top 0.254: Q2.1 105.35,16.19 102.78,18.75 IC2.9
N$10
  Top 0.254: IC2.8 102.16,18.11 103.76,16.51 103.76,13.21 104.59,12.38 Q7.1
N$11
  Top 0.254: IC2.7 101.92,17.45 103,16.38 103,10.03 104.52,8.51 105.52,8.51 Q8.1
N$12
  Top 0.254: IC2.6 101.81,16.8 102.36,16.26 102.36,5.59 103.19,4.76 Q9.1
N$13
  Top 0.254: Q2.3 108.58,15.24 109.22,15.88 JP1.9
N$14
  Top 0.254: Q7.3 108.58,11.43 110.49,13.34 JP1.11
N$15
  Top 0.254: Q8.3 108.58,7.62 111.76,10.79 JP1.13
N$16
  Top 0.254: JP1.15 113.03,8.26 108.58,3.81 Q9.3
N$17
  Top 0.254: Q3.3 108.58,30.48 113.03,26.04 JP1.1
N$18
  Top 0.254: Q4.3 108.58,26.67 111.76,23.5 JP1.3
N$19
  Top 0.254: Q5.3 108.58,22.86 110.49,20.95 JP1.5
N$20
  Top 0.254: Q6.3 108.58,19.05 109.22,18.41 JP1.7
N$21
  Top 0.61: X6.1 116.46,30.9 JP1.2 JP1.4 JP1.6 JP1.8 JP1.10 JP1.12 JP1.14 JP1.16
N$22
  Top 0.61: IC3.17 17.14,34.92
  Top 1.016: X2.2 13.97,21.63 13.97,31.75 17.14,34.92
N$23
  Top 0.61: IC3.14 18.41,38.73 18.03,38.35
  Top 1.016: X3.2 10.2,24.17 11.43,25.4 11.43,31.75 18.03,38.35
N$24
  Top 0.254: 17.65,40.01 17.53,40.13
  Top 0.61: IC3.13 17.65,40.01
  Top 1.016: X4.2 11.47,34.33 17.27,40.13 17.53,40.13
N$25
  Top 0.254: JP3.8 U$1.JP2.8
N$26
  Top 0.254: IC2.16 96.41,21.36 101.47,26.42 101.47,31.62 102.87,33.02 102.87,46.74 103,46.86 106.68,50.55 106.68,58.42 106.36,58.73 Q1.1
N$27
  Top 0.254: JP3.6 U$1.JP2.6
N$28
  Top 0.254: JP3.5 U$1.JP2.5
N$29
  Top 0.254: JP3.2 U$1.JP2.2
N$30
  Top 0.254: JP3.1 U$1.JP2.1
N$31
  Top 0.254: JP2.2 U$1.JP1.7
N$32
  Top 0.254: JP2.3 U$1.JP1.6
N$33
  Top 0.254: JP2.4 U$1.JP1.5
N$34
  Top 0.254: JP2.6 U$1.JP1.3
N$35
  Top 0.254: JP2.7 U$1.JP1.2
N$36
  Top 0.254: JP2.8 U$1.JP1.1
N$38
  Top 0.254: R3.1 40.12,47.44 J1.4
N$39
  Top 0.254: IC2.15 95.67,22 100.33,26.67 100.33,32.26 101.79,33.72 101.79,51.37 104.07,53.66 Q10.1
N$41
  Top 0.254: Q11.3 111.76,45.72 112.39,46.35 JP5.2
N$43
  Top 0.254: Q12.3 43.35,10.16 D2.C
  Bottom 0.254: D2.C K1.1
N$44
  Top 0.254: Q1.3 JP4.2
N$45
  Top 0.254: Q10.3 JP4.4
N$46
  Top 0.254: K2.1 88.9,14.35 92.71,10.54 D1.C 93.22,9.65 94.61,8.26 97.41,8.26 98.89,6.77 Q13.3
NC1
  Top 0.61: JP9.2 62.23,7.24 60.96,8.51 K1.3
NC2
  Top 0.61: JP6.2 52.07,13.21 54.1,15.24 58.42,15.24 K1.6
NO1
  Top 0.61: JP9.1 64.77,7.24 66.04,8.51 K1.4
NO2
  Top 0.61: JP6.3 54.61,7.75 53.72,8.64 53.72,11.81 55.37,13.46 61.72,13.46 K1.5
OUT1
  Top 0.254: 18.54,33.66 18.48,33.59
  Top 0.61: IC3.18 18.54,33.66 | 18.48,33.59 18.03,33.15
  Top 1.016: 18.03,33.15 16.51,31.62 16.51,19.05 12.7,15.24 12.7,7.62 8.93,3.85 X1.2
PCINT  (via drill 0.35)
  Top 0.254: JP2.5 U$1.JP1.4
  Top 0.305: v24,22.23 IC1.20
  Bottom 0.305: JP2.5 57.78,46.35 55.88,44.45 37.47,44.45 35.81,42.8 35.81,32 26.04,22.23 v24,22.23
SCL  (via drill 0.35)
  Top 0.254: JP3.3 U$1.JP2.3 85.72,48.9 | IC2.26 92.08,14.86 91.82,15.11 91.82,21.34 v86.49,26.67 84.07,29.08 84.07,43.94 85.72,45.59 85.72,48.9 | 85.72,48.9 R1.1 | IC1.12 34.04,26.04 34.67,26.67 v47.24,26.67 | v53.72,26.67 55.88,26.67 57.53,28.32 77.6,28.32 79.25,26.67 v80.64,26.67
  Bottom 0.254: v47.24,26.67 v53.72,26.67 | v80.64,26.67 v86.49,26.67
SDA  (via drill 0.35)
  Top 0.254: JP3.4 U$1.JP2.4 | IC2.27 91.59,14.21 91.06,14.73 91.06,20.57 v83.82,27.81 83.12,28.51 R2.1 v84.58,46.35 | IC1.13 34.04,27.3 34.16,27.43 45.97,27.43 46.35,27.81 v47.24,27.81 | v53.72,27.81 55.75,27.81 57.15,29.21 78.49,29.21 v79.88,27.81
  Bottom 0.254: v84.58,46.35 U$1.JP2.4 | v47.24,27.81 v53.72,27.81 | v83.82,27.81 v83.81,27.81 v79.88,27.81
VIC1
  Top 0.254: IC1.6 40.01,18.41 41.59,16.83 Q12.1
VIC2
  Top 0.254: IC1.7 40.39,19.68 42.93,17.14 42.93,15.88 45.97,12.83 45.97,2.16 47.24,0.89 94.36,0.89 95.25,1.78 95.25,5.46 95.82,6.03 Q13.1

### Text on the board
tValues: CampLet Power Ctrl / (c) Ludwig Bre / 04-2021 | FAN | + / - / + / - | - / IN / + | EN12 | - / O4 / + | TX / RX / D1 / D2 / D3 / D4 / G / 5V | - / 12V / + | RS / A0 / D0 / D5 / D6 / D7 / D8 / 3V | 1 | - + | - / O3 / + | - / O2 / + | 1 | 1 | 8 / 7 / 6 / 5 / 4 / 3 / 2 / 1 | - / O1 / + | COM NC NO | 1 VIC 2 | NO NC COM